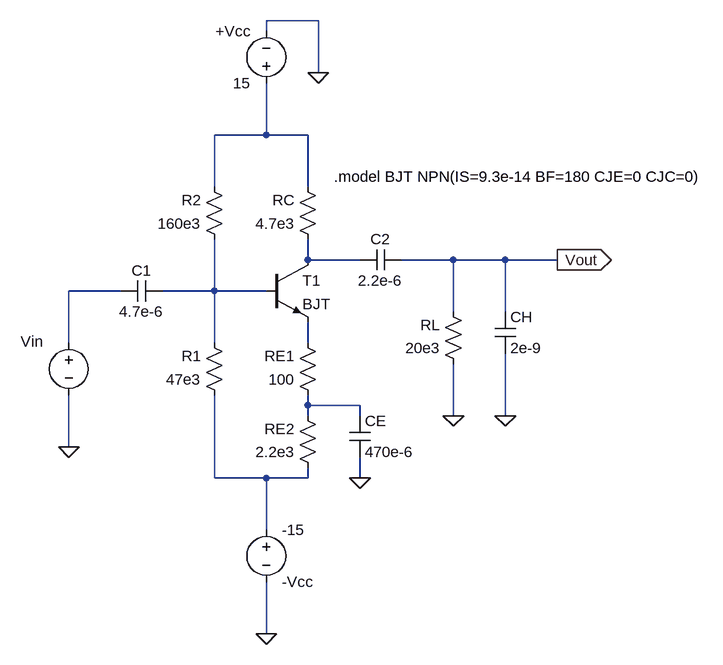
[diagram p0: schematic faz1.asc]
faz1.asc, the LTspice schematic file:
Version 4
SHEET 1 956 768
WIRE 64 -304 -16 -304
WIRE -16 -288 -16 -304
WIRE 64 -224 64 -304
WIRE -16 -128 -16 -208
WIRE -16 -128 -96 -128
WIRE 48 -128 -16 -128
WIRE -96 -48 -96 -128
WIRE 48 -48 48 -128
WIRE 48 64 48 32
WIRE 128 64 48 64
WIRE 272 64 192 64
WIRE 352 64 272 64
WIRE 432 64 352 64
WIRE -240 112 -320 112
WIRE -96 112 -96 32
WIRE -96 112 -176 112
WIRE -16 112 -96 112
WIRE 272 144 272 64
WIRE 352 144 352 64
WIRE -320 192 -320 112
WIRE -96 192 -96 112
WIRE 48 192 48 160
WIRE 48 288 48 272
WIRE 128 288 48 288
WIRE 48 304 48 288
WIRE 128 304 128 288
WIRE 272 304 272 224
WIRE 352 304 352 208
WIRE -320 352 -320 272
WIRE -96 400 -96 272
WIRE -16 400 -96 400
WIRE 48 400 48 384
WIRE 48 400 -16 400
WIRE 128 400 128 368
WIRE -16 480 -16 400
WIRE -16 640 -16 560
FLAG 272 304 0
FLAG 128 400 0
FLAG 64 -224 0
FLAG 432 64 Vout
IOPIN 432 64 Out
FLAG -320 352 0
FLAG -16 640 0
FLAG 352 304 0
SYMBOL cap -176 96 R90
WINDOW 0 0 32 VBottom 2
WINDOW 3 32 32 VTop 2
SYMATTR InstName C1
SYMATTR Value 4.7e-6
SYMBOL res -80 48 R180
WINDOW 0 36 76 Left 2
WINDOW 3 36 40 Left 2
SYMATTR InstName R2
SYMATTR Value 160e3
SYMBOL res -80 288 R180
WINDOW 0 36 76 Left 2
WINDOW 3 36 40 Left 2
SYMATTR InstName R1
SYMATTR Value 47e3
SYMBOL npn -16 64 R0
SYMATTR InstName T1
SYMATTR Value BJT
SYMBOL res 64 48 R180
WINDOW 0 36 76 Left 2
WINDOW 3 36 40 Left 2
SYMATTR InstName RC
SYMATTR Value 4.7e3
SYMBOL cap 192 48 R90
WINDOW 0 0 32 VBottom 2
WINDOW 3 32 32 VTop 2
SYMATTR InstName C2
SYMATTR Value 2.2e-6
SYMBOL res 288 240 R180
WINDOW 0 36 76 Left 2
WINDOW 3 36 40 Left 2
SYMATTR InstName RL
SYMATTR Value 20e3
SYMBOL res 64 288 R180
WINDOW 0 36 76 Left 2
WINDOW 3 36 40 Left 2
SYMATTR InstName RE1
SYMATTR Value 100
SYMBOL res 64 400 R180
WINDOW 0 36 76 Left 2
WINDOW 3 36 40 Left 2
SYMATTR InstName RE2
SYMATTR Value 2.2e3
SYMBOL cap 112 304 R0
SYMATTR InstName CE
SYMATTR Value 470e-6
SYMBOL voltage -16 464 R0
WINDOW 0 24 96 Left 2
WINDOW 3 24 16 Left 2
WINDOW 123 0 0 Left 0
WINDOW 39 0 0 Left 0
SYMATTR InstName -Vcc
SYMATTR Value -15
SYMBOL voltage -16 -192 R180
WINDOW 0 24 96 Left 2
WINDOW 3 24 16 Left 2
WINDOW 123 0 0 Left 0
WINDOW 39 0 0 Left 0
SYMATTR InstName +Vcc
SYMATTR Value 15
SYMBOL voltage -320 176 R0
WINDOW 123 -74 42 Left 2
WINDOW 39 0 0 Left 0
WINDOW 0 -74 14 Left 2
WINDOW 3 -74 42 Left 2
SYMATTR InstName Vin
SYMATTR Value ""
SYMBOL cap 336 144 R0
SYMATTR InstName CH
SYMATTR Value 2e-9
TEXT 88 -64 Left 2 !.model BJT NPN(IS=9.3e-14 BF=180 CJE=0 CJC=0)

The netlist it stands for:
* faz1.asc
C1 N004 N003 4.7e-6
R2 N004 N001 160e3
R1 N007 N004 47e3
Q§T1 N002 N004 N005 0 BJT
RC N002 N001 4.7e3
C2 Vout N002 2.2e-6
RL 0 Vout 20e3
RE1 N006 N005 100
RE2 N007 N006 2.2e3
CE N006 0 470e-6
V§-Vcc N007 0 -15
V§+Vcc N001 0 15
Vin N003 0
CH Vout 0 2e-9
.model NPN NPN
.model PNP PNP
.lib standard.bjt
.model BJT NPN(IS=9.3e-14 BF=180 CJE=0 CJC=0)
.backanno
.end